# EAGLE design LM34_LCD_SHIELD (EAGLE 6.4)
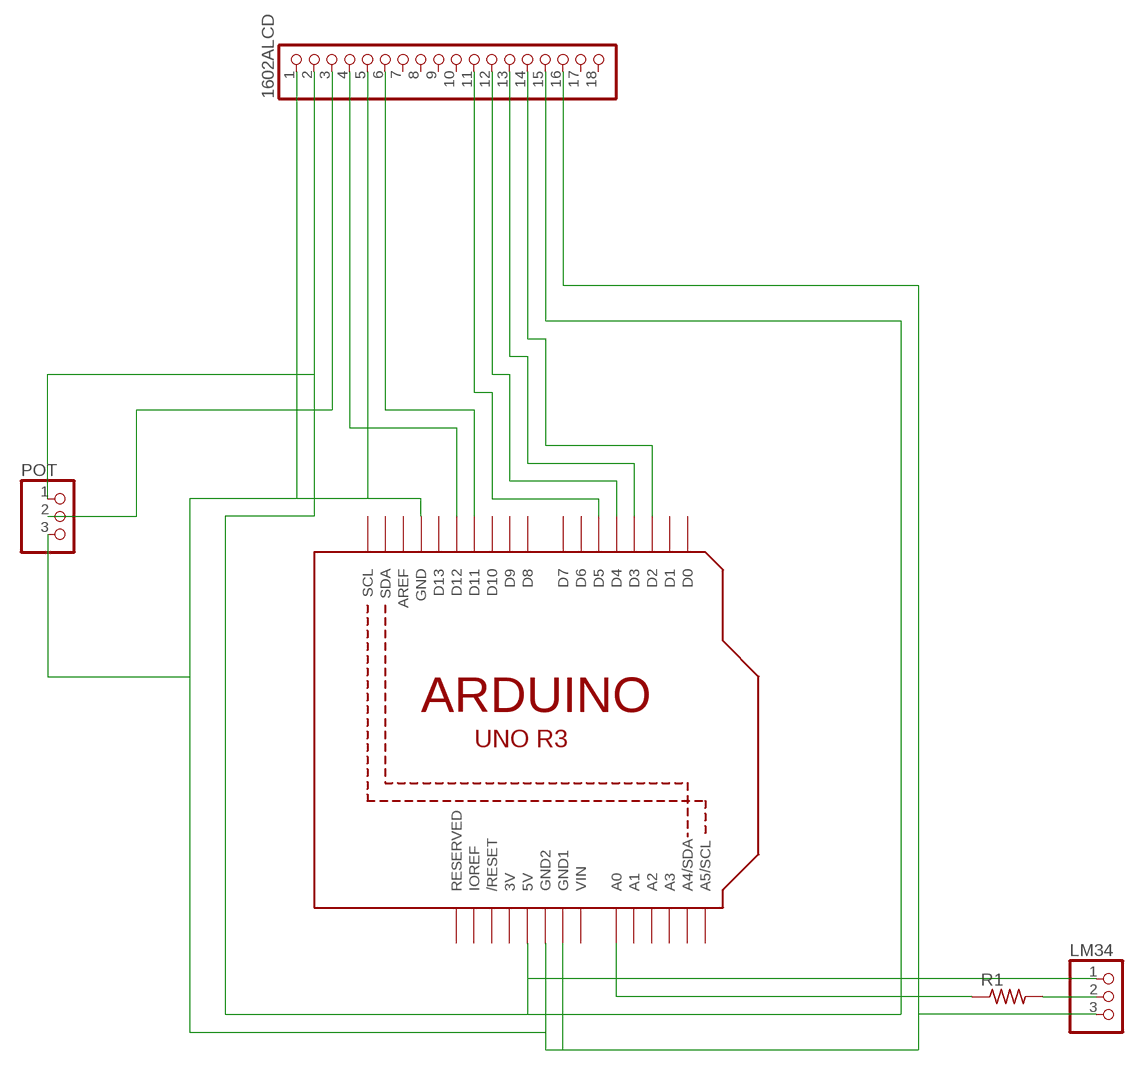
[diagram p0: schematic, sheet 1]

## Parts
1602ALCD  PINHD-1X18  [1X18]
LM34  PINHD-1X3CB  [1X03-CLEANBIG]
POT  PINHD-1X3CB  [1X03-CLEANBIG]
R1  R-US_0207/5V  [0207/5V]
U1  ARDUINOR3-BPLACE  [ARDUINOR3-BPLACE]

## Nets
5V: 1602ALCD.2 1602ALCD.15 LM34.1 POT.1 U1.5V
N$1: 1602ALCD.4 U1.D12
N$2: LM34.2 R1.2
N$3: 1602ALCD.14 U1.D2
N$4: 1602ALCD.6 U1.D11
N$5: 1602ALCD.11 U1.D5
N$6: 1602ALCD.12 U1.D4
N$7: 1602ALCD.13 U1.D3
N$8: R1.1 U1.A0
N$9: 1602ALCD.3 POT.2
N$10: 1602ALCD.1 1602ALCD.5 1602ALCD.16 LM34.3 POT.3 U1.GND U1.GND1 U1.GND2
Unconnected: 1602ALCD.7 1602ALCD.8 1602ALCD.9 1602ALCD.10 1602ALCD.17 1602ALCD.18 U1.A1 U1.A2 U1.A3 U1.A4(A4/SDA) U1.A5(A5/SCL) U1.AREF U1.D0 U1.D1 U1.D6 U1.D7 U1.D8 U1.D9 U1.D10 U1.D13 U1.IOREF U1.RESERVED U1.RESET(/RESET) U1.SCL U1.SDA

## Power pins joined to a net without a drawn wire
3V: U1.3V
VIN: U1.VIN

## Library data of the parts
1602ALCD = adafruit:PINHD-1X18: PIN HEADER
LM34 POT = adafruit:PINHD-1X3: PIN HEADER
R1 = adafruit:R-US_: RESISTOR, American symbol
U1 = adafruit:ARDUINOR3: This is a new object for the new Arduino R3 - with extra pins that you may want to use (such as IOref, and duplicated A4/A5

## Board
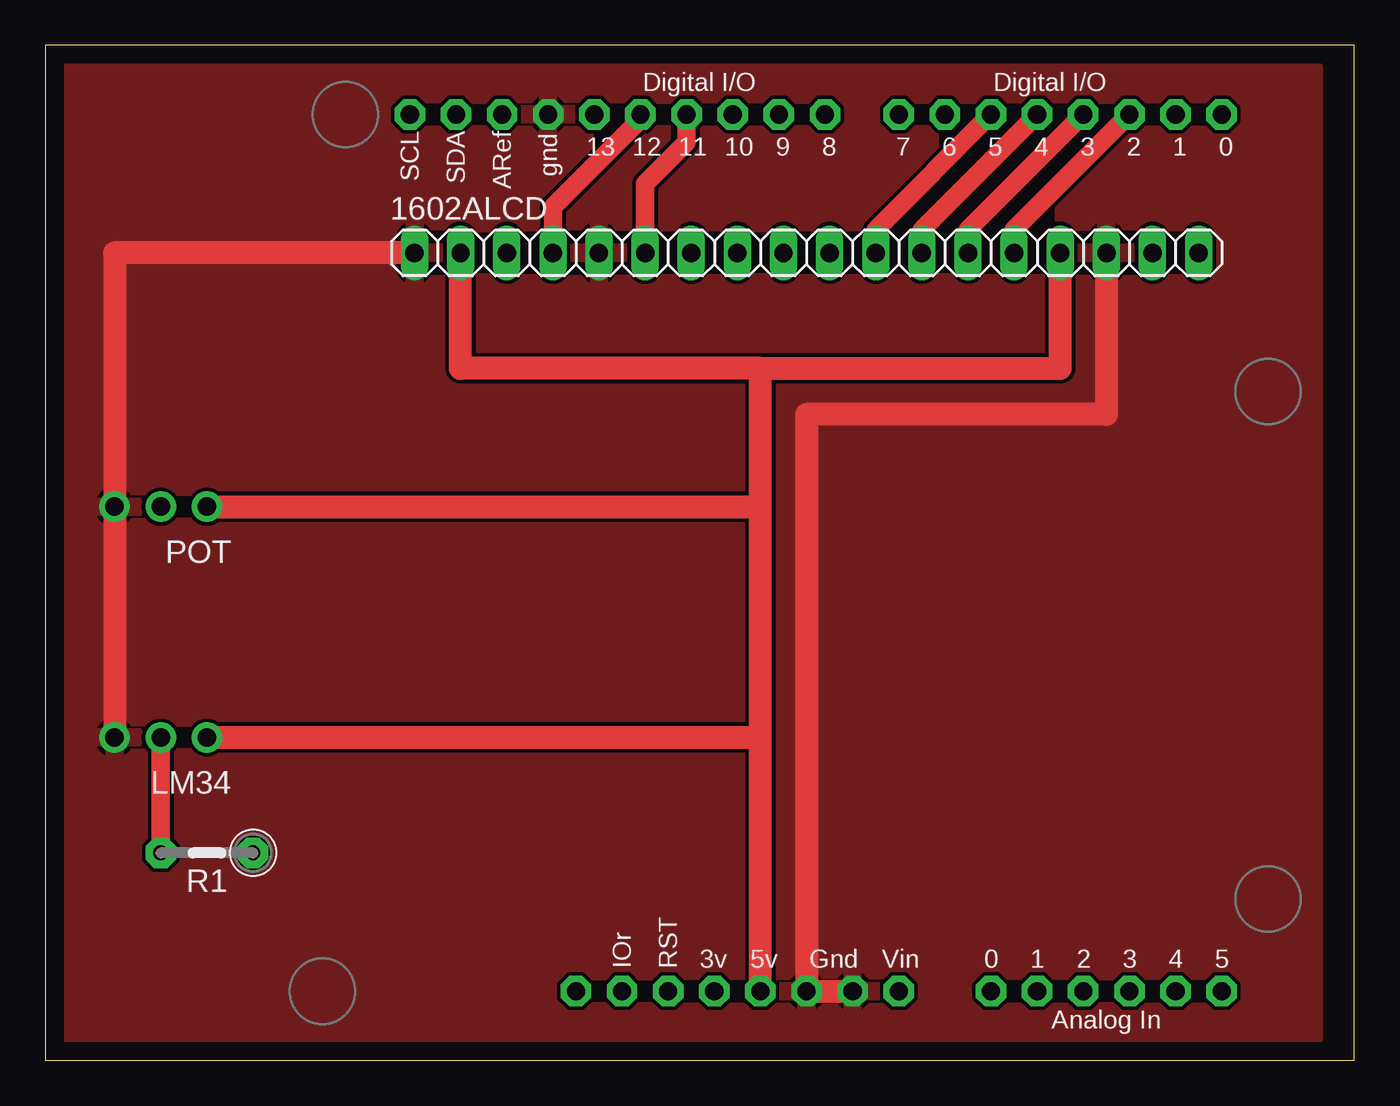
[diagram p1: board, top side]
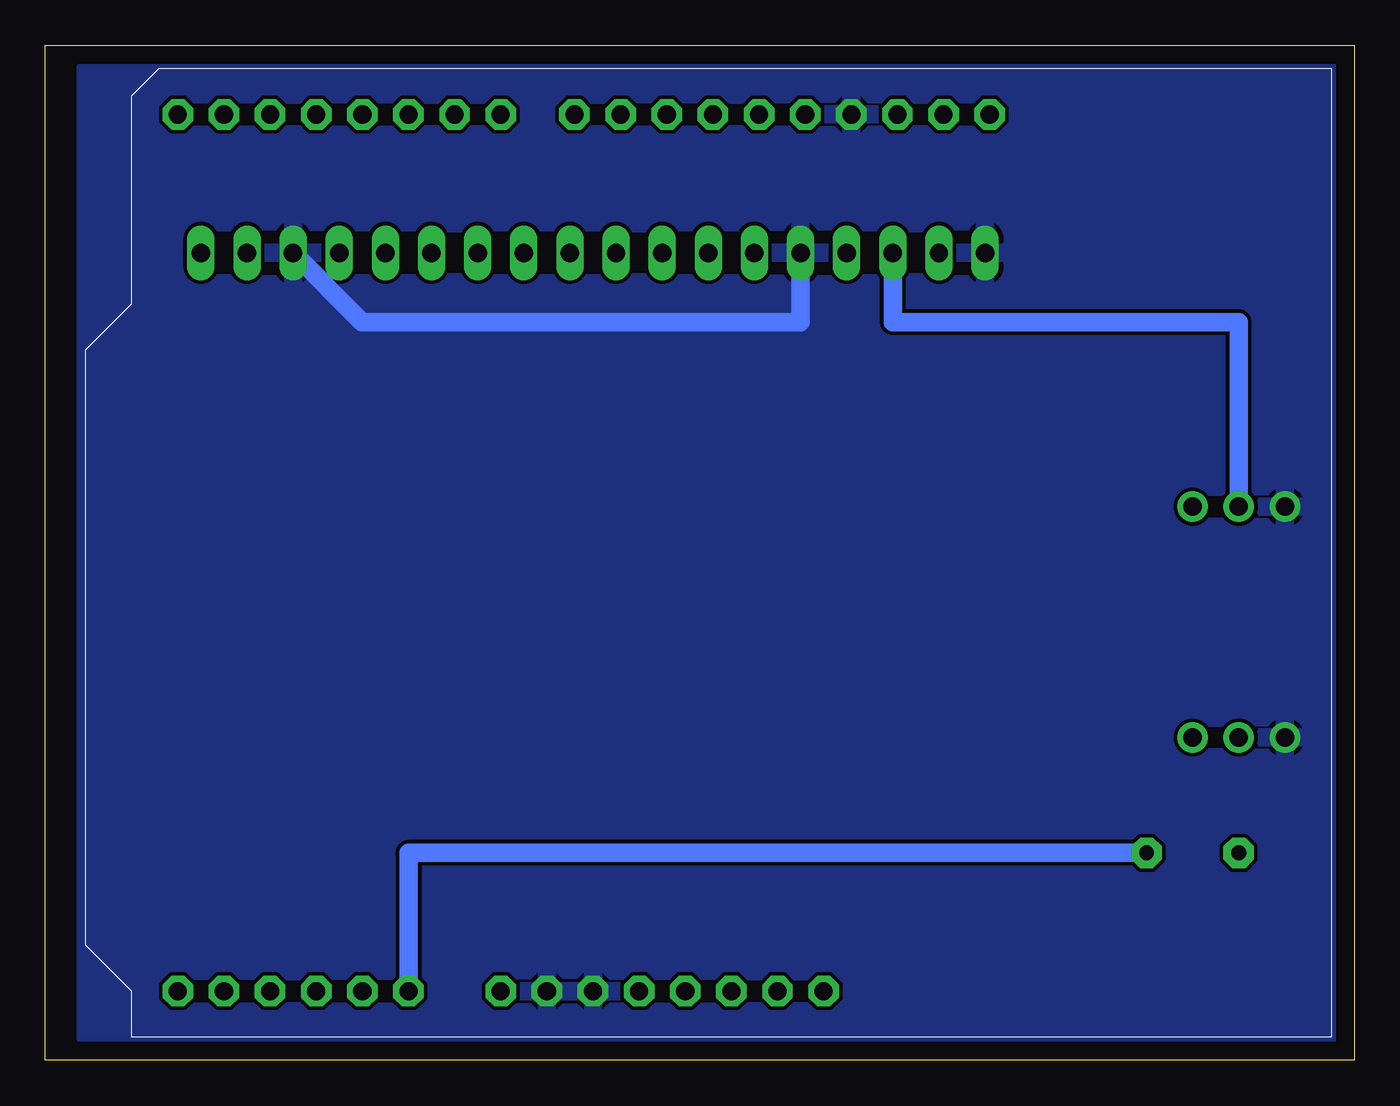
[diagram p2: board, bottom side, seen from below]

Size 72.06 x 55.87 mm. Coordinates in mm from the lower left corner, seen from the top.
Outline: 0,0 72.06,0 72.06,55.87 0,55.87 0,0
Copper layers (1*16): Top 0.035mm / dielectric 1.5mm / Bottom 0.035mm
Design rules "default": minimum track width 10mil, minimum drill 24mil, track to track 8mil, track to pad 8mil, pad to pad 8mil, via to via 8mil, smd to smd 8mil, copper to edge 40mil, drill to drill 8mil, minimum pad ring 10mil, minimum via ring 8mil, stop-mask expansion 4mil, vias tented up to drill 0mil, thermal gap 10mil

### Footprints (pad centres in the part's own frame; a part is rotated, then mirrored left to right if it is on the bottom)
1X18 = drill 1.016 long: 1 -21.59,0; 2 -19.05,0; 3 -16.51,0; 4 -13.97,0; 5 -11.43,0; 6 -8.89,0; 7 -6.35,0; 8 -3.81,0; 9 -1.27,0; 10 1.27,0; 11 3.81,0; 12 6.35,0; 13 8.89,0; 14 11.43,0; 15 13.97,0; 16 16.51,0; 17 19.05,0; 18 21.59,0
1X03-CLEANBIG = drill 1.016 pad 1.676: 1 -2.54,0; 2 0,0; 3 2.54,0
0207/5V = drill 0.813 pad 1.676 octagon: 1 -2.54,0; 2 2.54,0
ARDUINOR3-BPLACE = drill 1 pad 1.676 octagon: 3V 35.56,2.54; 5V 38.1,2.54; A0 50.8,2.54; A1 53.34,2.54; A2 55.88,2.54; A3 58.42,2.54; A4 60.96,2.54; A5 63.5,2.54; AREF 23.876,50.8; D0 63.5,50.8; D1 60.96,50.8; D2 58.42,50.8; D3 55.88,50.8; D4 53.34,50.8; D5 50.8,50.8; D6 48.26,50.8; D7 45.72,50.8; D8 41.656,50.8; D9 39.116,50.8; D10 36.576,50.8; D11 34.036,50.8; D12 31.496,50.8; D13 28.956,50.8; GND 26.416,50.8; GND1 43.18,2.54; GND2 40.64,2.54; IOREF 30.48,2.54; RESERVED 27.94,2.54; RESET 33.02,2.54; SCL 18.796,50.8; SDA 21.336,50.8; VIN 45.72,2.54

### Placement (x,y rotation side)
1602ALCD  41.91,44.45 0 top
LM34  6.35,17.78 180 top
POT  6.35,30.48 180 top
R1  8.89,11.43 180 top
U1  1.27,1.27 0 top

### Tracks (layer width: path | path; a pad name or v marks a point on that pad's centre or on a via)
5V
  Top 1.27: U1.5V 39.37,17.78 | 39.37,17.78 39.37,30.48 | 39.37,30.48 39.37,38.1 | 39.37,38.1 55.88,38.1 1602ALCD.15 | 39.37,38.1 22.86,38.1 1602ALCD.2 | POT.1 39.37,30.48 | LM34.1 39.37,17.78
N$1
  Top 1.016: U1.D12 32.77,51.82 27.94,46.99 1602ALCD.4
N$2
  Top 1.016: LM34.2 R1.2
N$3
  Top 0.406: 53.34,45.72 1602ALCD.14
  Top 1.016: U1.D2 53.34,45.72
N$4
  Top 1.016: U1.D11 35.31,50.55 33.02,48.26 1602ALCD.6
N$5
  Top 0.406: 45.72,45.72 1602ALCD.11
  Top 1.016: U1.D5 45.72,45.72
N$6
  Top 0.406: 48.26,45.72 1602ALCD.12
  Top 1.016: U1.D4 48.26,45.72
N$7
  Top 0.406: 50.8,45.72 1602ALCD.13
  Top 1.016: U1.D3 50.8,45.72
N$8
  Bottom 1.016: R1.1 52.07,11.43 U1.A0
N$9
  Bottom 1.016: POT.2 6.35,40.64 25.4,40.64 1602ALCD.3
N$10
  Top 1.27: 1602ALCD.1 3.81,44.45 POT.3 LM34.3 | 1602ALCD.16 58.42,35.56 41.91,35.56 U1.GND2 U1.GND1
  Bottom 1.016: 1602ALCD.5 30.48,40.64 54.61,40.64 1602ALCD.16
  pour Bottom: 1.27,54.61 69.85,54.61 69.85,1.27 1.27,1.27
  pour Top: 1.27,54.61 69.85,54.61 69.85,1.27 1.27,1.27